# Altium schematic sheet Buck Converter and BEC Systems.SchDoc
size 420 x 297 mm; Author: Denizhan ALTAY; SheetNumber: 3; SheetTotal: 6
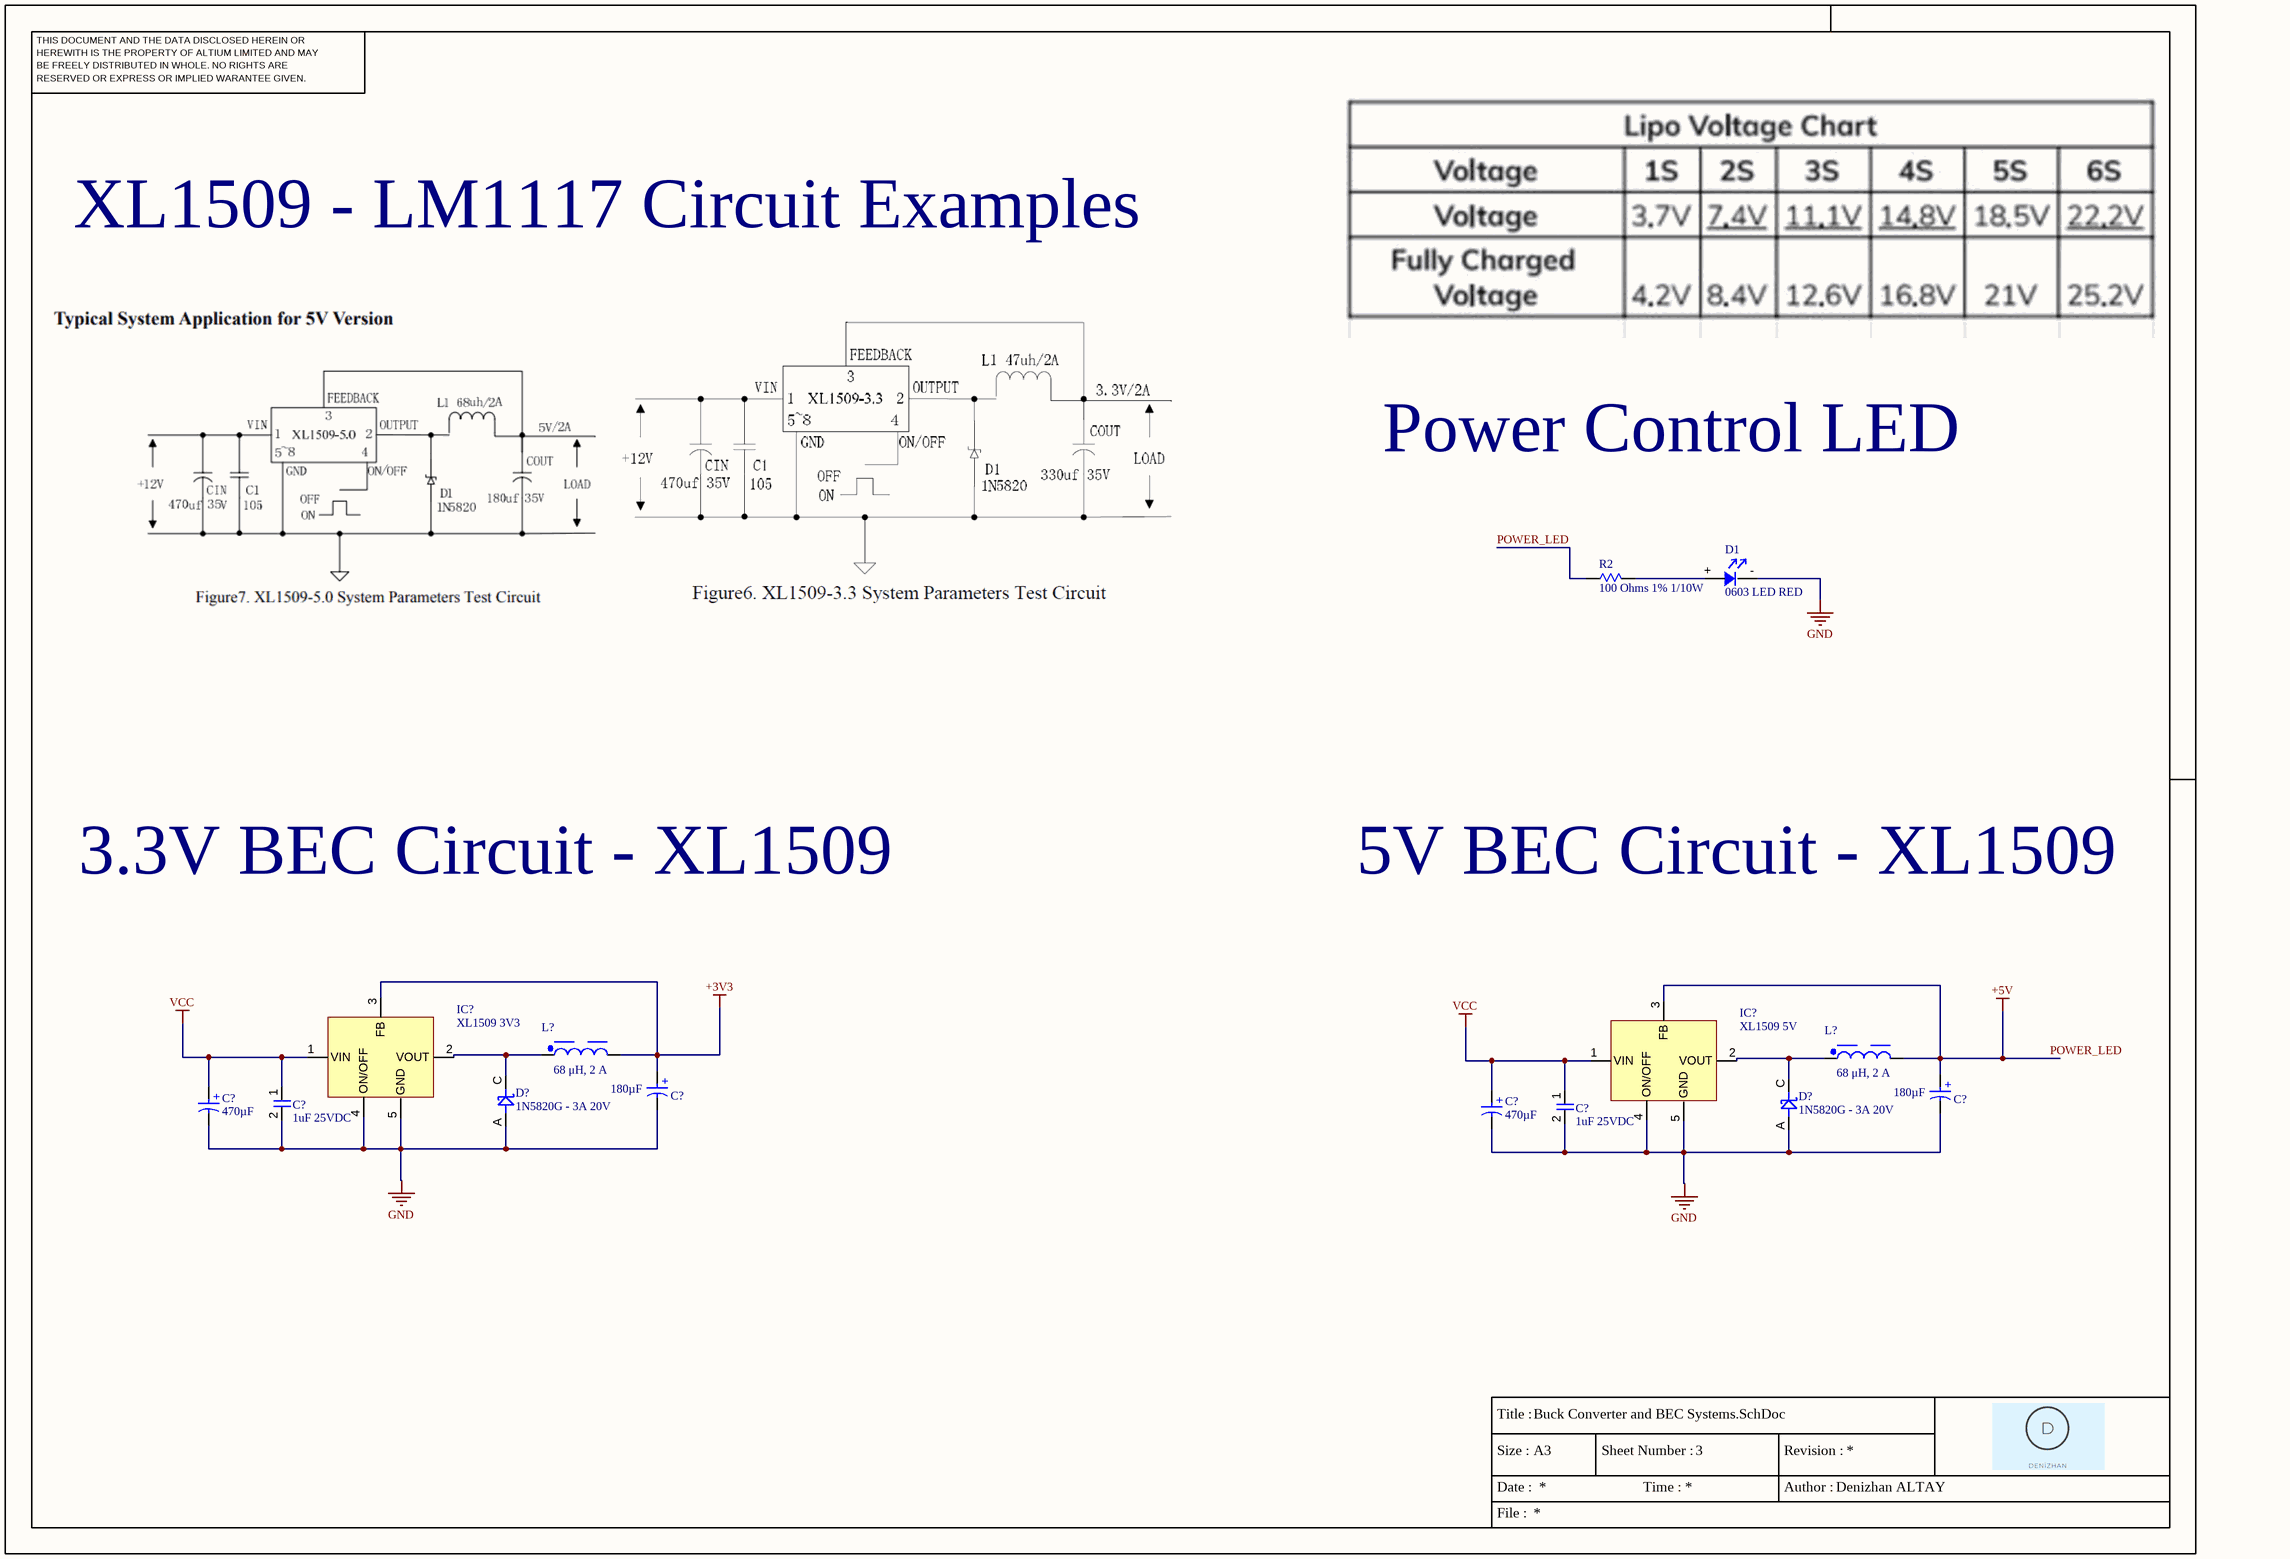
[diagram p0: Buck Converter and BEC Systems.SchDoc]

## Parts
(Parts that share a designator on the sheet are numbered #1, #2 ... from top to bottom, then left to right.)
C?#1  180µF  [WCAP-ATG5_D8H11.5]
C?#2  180µF  [WCAP-ATG5_D8H11.5]
C?#3  470µF  [WCAP-ATG5_D10H16]
C?#4  470µF  [WCAP-ATG5_D10H16]
C?#5  1uF 25VDC  [0603_UnP_Capacitor]
C?#6  1uF 25VDC  [0603_UnP_Capacitor]
D1  0603 LED RED  [LED Diode 0603]
D?#1  1N5820G - 3A 20V  [1n5820g]
D?#2  1N5820G - 3A 20V  [1n5820g]
IC?#1  XL1509 3V3  [XL1509_3.3E1]
IC?#2  XL1509 5V  [XL1509_5E1]
L?#1  68 μH, 2 A  [WE-PD_1260]
L?#2  68 μH, 2 A  [WE-PD_1260]
R2  100 Ohms 1% 1/10W  [0603_Resistor_Case]

## Nets
+3V3: C?#1.1(P) IC?#1.3(FB) L?#1.2
GND: C?#1.2(N) C?#2.2(N) C?#3.2(N) C?#4.2(N) C?#5.2 C?#6.2 D1.- D?#1.A D?#2.A IC?#1.4(ON/OFF) IC?#1.5(GND) IC?#2.4(ON/OFF) IC?#2.5(GND)
POWER_LED: C?#2.1(P) IC?#2.3(FB) L?#2.2 R2.1  [also labelled +5V]
VCC: C?#3.1(P) C?#4.1(P) C?#5.1 C?#6.1 IC?#1.1(VIN) IC?#2.1(VIN)
NetD1_+: D1.+ R2.2
NetD?#1_C: D?#1.C IC?#1.2(VOUT) L?#1.1
NetD?#2_C: D?#2.C IC?#2.2(VOUT) L?#2.1

## Notes on the sheet
- XL1509 - LM1117 Circuit Examples
- Power Control LED
- 3.3V BEC Circuit - XL1509
- 5V BEC Circuit - XL1509
- THIS DOCUMENT AND THE DATA DISCLOSED HEREIN OR
- HEREWITH IS THE PROPERTY OF ALTIUM LIMITED AND MAY
- BE FREELY DISTRIBUTED IN WHOLE. NO RIGHTS ARE
- RESERVED OR EXPRESS OR IMPLIED WARANTEE GIVEN.
- Title :
- Size :
- Date :
- A3
- Sheet Number :
- Time :
- Revision :
- Author :
- File :
- (in symbol 860020574011) +
- (in symbol 860020575014) +

## Library data of the parts
C?#1 C?#2 = 860020574011: WCAP-ATG5 Aluminum Electrolytic Capacitor, Radial, THT, D8 x H11.5mm, 180µF, 35V; Manufacturer: Wurth Elektronik; Capacitance Tolerance: +/-20%; Dissipation Factor: 12%; Endurance: 2000h; Leakage Current: 63µA; Ripple Current: 225mA; Technical Reference: ATDE115181M035DSPA7B000; Manufacturer Part Number: 860020574011; Category: Aluminum Electrolytic Capacitors; Match Code: WCAP-ATG5; ComponentLink1Description: Website Link; ComponentLink1URL: https://www.we-online.com/redexpert/article/860020574011?ad; ComponentLink2Description: Datasheet Link; ComponentLink2URL: https://www.we-online.com/redexpert/spec/860020574011?ad; Operating Temperature Max: 105°C; Operating Temperature Min: -40°C; Packaging: Ammo Pack; Height: 11.5mm; Diameter: 8mm; Capacitance: 180µF; Rated Voltage (DC): 35V; Package: THT; Library Ref: Capacitors; Capacitor Type: Electrolytic
C?#3 C?#4 = 860020575014: WCAP-ATG5 Aluminum Electrolytic Capacitor, Radial, THT, D10 x H16mm, 470µF, 35V; Manufacturer: Wurth Elektronik; Capacitance Tolerance: +/-20%; Dissipation Factor: 12%; Endurance: 2000h; Leakage Current: 164.5µA; Ripple Current: 520mA; Technical Reference: ATDF160471M035DSPAAB000; Manufacturer Part Number: 860020575014; Category: Aluminum Electrolytic Capacitors; Match Code: WCAP-ATG5; ComponentLink1Description: Website Link; ComponentLink1URL: https://www.we-online.com/redexpert/article/860020575014?ad; ComponentLink2Description: Datasheet Link; ComponentLink2URL: https://www.we-online.com/redexpert/spec/860020575014?ad; Operating Temperature Max: 105°C; Operating Temperature Min: -40°C; Packaging: Ammo Pack; Height: 16mm; Diameter: 10mm; Capacitance: 470µF; Rated Voltage (DC): 35V; Package: THT; Library Ref: Capacitors; Capacitor Type: Electrolytic
C?#5 C?#6 = MCF03KTB250105 - MLCC (1608) 0603 1uF 25VDC ±10% X7R: Manufacturer: VIKING; Part Number: MCF03MTX250106; Capacitor Type: Ceramic; Library Ref: Capacitors; Package / Case: 0603; ComponentLink1Description: New link; ComponentLink1URL: https://www.ozdisan.com/passive-components/resistors/smt-smd-and-chip-resistors/PS03W4F1003T5E/592727; Max Working Voltage: 25VDC; Availability: Available; Package: SMD; Capacitance: 1uF
D1 = 0603 LED RED: Type: SMD; Library Ref: LED; Package / Case: 0603; Color: Red
D?#1 D?#2 = 1N5820G: 1N5820G -DIODE SWITCHING Single 3A 20V THT; Type: Schottky; Library Ref: Diodes; Diode Types: Switching; Availability: Available; Package: THT; Working Voltage (Max): 20V; Rated Current (Max): 3A
IC?#1 = XL1509-3V3: Voltage Regulator; Manufacturer: XLSEMI; Regulator Type: Buck; Output Voltage (Max): 3.3V; Output Current (Max): 2A; Input Voltage (Min): 5V; Input Voltage (Max): 40V; Library Ref: Voltage Regulators; Availability: Available; Package: SMD; Output Voltage: 3.3V
IC?#2 = XL1509-5V: Voltage Regulator; Manufacturer: XLSEMI; Output Current (Max): 2A; Input Voltage (Max): 40V; Regulator Type: Buck; Library Ref: Voltage Regulators; Output Voltage (Max): 5V; Input Voltage (Min): 5V; Availability: Available; Package: SMD
L?#1 L?#2 = 744771168: WE-PD SMT Power Inductor, size 1260, 68 μH, 2 A, 105 mΩ; Manufacturer: Wurth Elektronik; Case/Size Code: 1260; DC Resistance: 86 mΩ; DC Resistance Max: 105 mΩ; Inductance: 68 μH; Rated Current: 2 A; Saturation Current: 2.2 A; Self Resonant Frequency: 7.6 MHz; Type: Standard; Manufacturer Part Number: 744771168; Category: Power Inductors; Match Code: WE-PD; ComponentLink1Description: Website Link; ComponentLink1URL: https://www.we-online.com/redexpert/article/744771168?ad; ComponentLink2Description: Datasheet Link; ComponentLink2URL: https://www.we-online.com/redexpert/spec/744771168?ad; Min Operating Temperature: -40 °C; Max Operating Temperature: 125 °C; Packaging: Tape and Reel; Length: 12 mm; Width: 12 mm; Height: 6 mm; Library Ref: Inductors; Package: SMD
R2 = CQ03SAF1000T5E - 0603 100 Ohms 1% 1/10W AUTOMOTIV: Manufacturer: ROYALOHM; Working Voltage (Max): 75V; Library Ref: Resistors; Package / Case: 0603; Power (Watts): 1/10W; Resistor Value: 100 Ohms; Part Number: CQ03SAF1000T5E; ComponentLink1Description: New link; ComponentLink1URL: https://www.ozdisan.com/passive-components/resistors/smt-smd-and-chip-resistors/PS03W4F1003T5E/592727